# Altium schematic sheet Vibrator.SchDoc: Vibration motor
size A4; Author: Sajitha Madugalle; Revision: 1; SheetNumber: 6; SheetTotal: 9
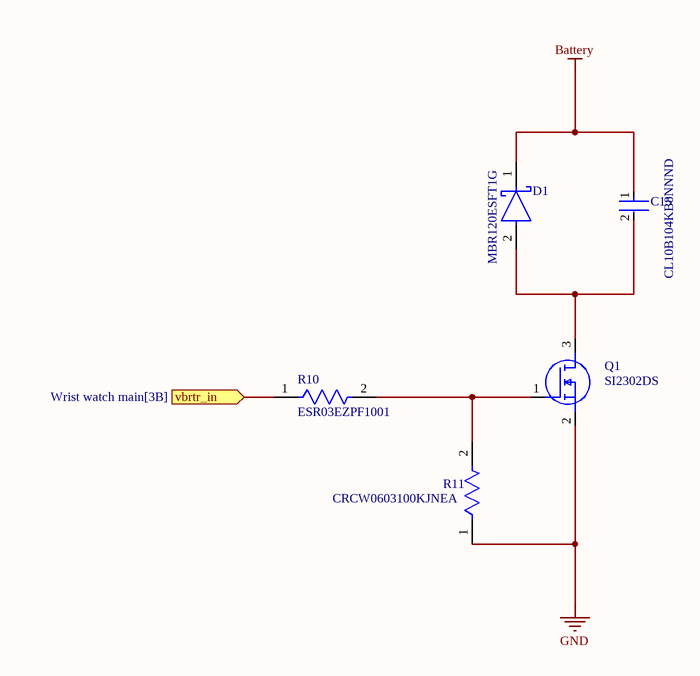
[diagram p0: Vibrator.SchDoc]

## Parts
C15  CL10B104KB8NNND  [FP-CL10-IPC_A]
D1  MBR120ESFT1G  [On_Semiconductor_498_MFG]
Q1  SI2302DS  [SOT95P230X110-3N]
R10  ESR03EZPF1001  [FP-ESR03-IPC_A]
R11  CRCW0603100KJNEA  [FP-CRCW0603-e3-IPC_C]

## Ports
vbrtr_in (in, see Wrist watch main[3B])

## Nets
Battery: C15.1 D1.1(C)
GND: Q1.2(S) R11.1
vbrtr_in: R10.1 ; port vbrtr_in
NetC15_2: C15.2 D1.2(A) Q1.3(D)
NetQ1_1: Q1.1(G) R10.2 R11.2

## Notes on the sheet
- Title:
- Size:
- Document Number :
- Revision
- Drawn by:
- Checked by:
- Date:
- A4
- Time:
- Aprooved by:
- Sheet:
- of
- File:

## Library data of the parts
C15 = CMP-13271-000587-1: Cap Ceramic 100nF 50V X7R ±10% Pad SMD 0603 +125°C T/R; Case/Package: 0603; Depth: 0.8mm; Max Operating Temperature: 125°C; Lead Free: Lead Free; Material: Ceramic; Voltage Rating: 50V; Min Operating Temperature: -55°C; Voltage Rating (DC): 50V; Dielectric: X7R; Height: 0.8mm; Capacitance: 100nF; Thickness: 0.035inch; Radiation Hardening: No; Voltage: 50V; Packaging: Tape and Reel; Length: 1.6mm; Tolerance: 10%; Width: 0.031inch; Mount: Surface Mount; Package Quantity: 10000
D1 = CMP-1055-00434-2: NexarPartId: 330787; Manufacturer Lifecycle Status: ACTIVE; Voltage Rating (DC): 20V; Max Forward Surge Current (Ifsm): 40A; Output Current: 1A; Max Junction Temperature (Tj): 150°C; Polarity: Standard; Peak Reverse Current: 10µA; Element Configuration: Single; Forward Voltage: 530mV; Lifecycle Status: Production; Packaging: Cut Tape; Lead Free: Lead Free; Radiation Hardening: No; Min Operating Temperature: -65°C; Average Rectified Current: 1A; Current Rating: 1A; Max Reverse Voltage (DC): 20V; RoHS: Compliant; REACH SVHC: No SVHC; Max Surge Current: 40A; Length: 2.9mm; Forward Current: 1A; Height: 880µm; Contact Plating: Tin; Width: 1.8mm; Reverse Voltage: 20V; Schedule B: 8541100080; Peak Non-Repetitive Surge Current: 40A; Max Operating Temperature: 150°C; Max Repetitive Reverse Voltage (Vrrm): 20V; Max Reverse Leakage Current: 10µA; Number of Pins: 2; Halogen Free: Halogen Free
Q1 = SI2302DS: MOSFET (N-Channel); Manufacturer_Name: Nexperia; Datasheet Link: https://assets.nexperia.com/documents/data-sheet/SI2302DS.pdf; Height: 1.1mm; Manufacturer_Part_Number: SI2302DS; Mouser Part Number: N/A; Mouser Price/Stock: https://www.mouser.com/Search/Refine.aspx?Keyword=N%2FA
R10 = CMP-08839-029483-1: 1kΩ ±1% 0.25W 0603 Anti-Surge Chip Resistor AEC-Q200; Power Rating: 250mW; Resistance: 1kR; Temperature Coefficient: 100ppm/°C; Series: ESR; Max Operating Temperature: 155°C; Case Code (Metric): 1608; Package Quantity: 1; Case/Package: 0603; Size Code: 0603; Case Code (Imperial): 0603; Min Operating Temperature: -55°C; Tolerance: 1%; Max Power Dissipation: 250mW; Number of Terminations: 2; RoHS Compliant: Yes; Lead Free: Lead Free; Packaging: Tape and Reel; Height: 0.022inch; Width: 0.031inch; Features: Automotive AEC-Q200; Resistor Type: Thick Film; Length: 0.063inch
R11 = CMP-2000-03823-2: RES Thick Film, 100kΩ, 5%, 0.1W, 200ppm/°C, 0603; Power Rating: 100mW; Voltage Rating: 75V; Resistance: 100kR; Radiation Hardening: No; Min Operating Temperature: -55°C; Width: 0.85mm; Case Code (Metric): 1608; Max Power Dissipation: 100mW; Composition: Thick Film; Temperature Coefficient: 200ppm/°C; Tolerance: 5%; Termination: SMD/SMT; Military Standard: Not; Weight: 7.1E-05oz; Number of Pins: 2; Mount: Surface Mount; Depth: 0.85mm; Max Operating Temperature: 155°C; Case/Package: 0603; Working Voltage: 75V; Number of Terminations: 2; Package Quantity: 1; Case Code (Imperial): 0603; Contact Plating: Tin; Length: 1.55mm; Packaging: Tape and Reel; Height: 0.02inch; Features: Automotive AEC-Q200